# Altium schematic sheet CubSat3.SchDoc: CubSat
size A4; DrawnBy: Maymoun Jabnouni; SheetNumber: 3; SheetTotal: 3
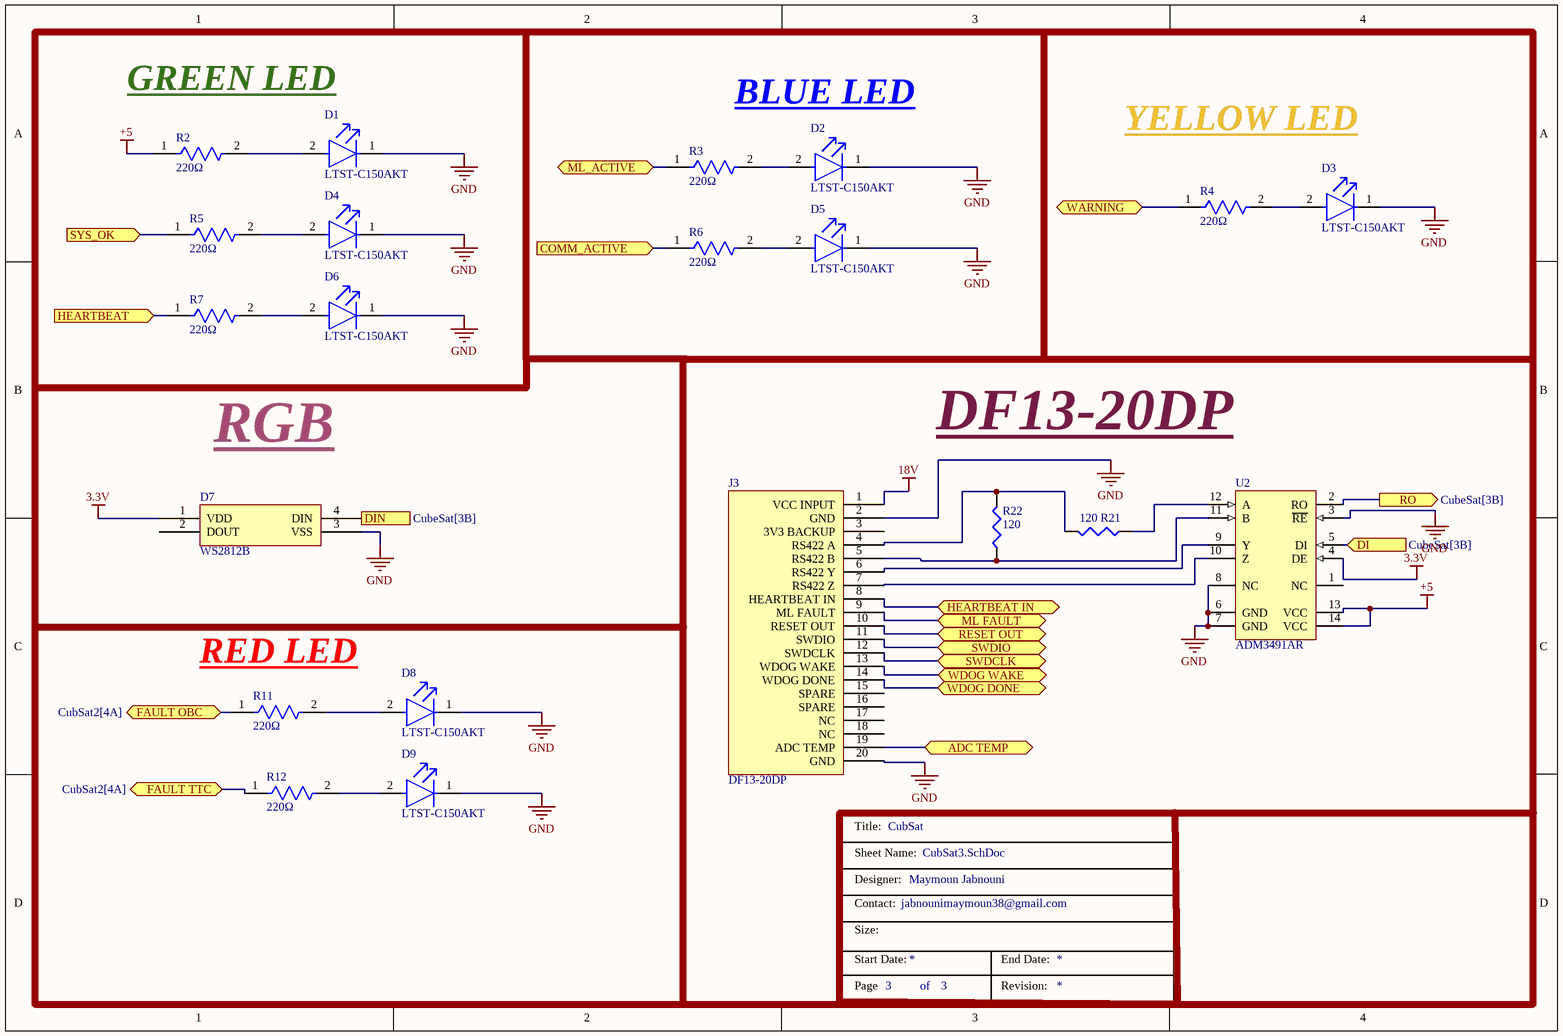
[diagram p0: CubSat3.SchDoc]

## Parts
D1  LTST-C150AKT  [FP-LTST-C150AKT-MFG]
D2  LTST-C150AKT  [FP-LTST-C150AKT-MFG]
D3  LTST-C150AKT  [FP-LTST-C150AKT-MFG]
D4  LTST-C150AKT  [FP-LTST-C150AKT-MFG]
D5  LTST-C150AKT  [FP-LTST-C150AKT-MFG]
D6  LTST-C150AKT  [FP-LTST-C150AKT-MFG]
D7  WS2812B  [WS2812B]
D8  LTST-C150AKT  [FP-LTST-C150AKT-MFG]
D9  LTST-C150AKT  [FP-LTST-C150AKT-MFG]
J3  DF13-20DP  [DF13-20DP]
R2  220Ω  [FP-RMCF0603-MFG]
R3  220Ω  [FP-RMCF0603-MFG]
R4  220Ω  [FP-RMCF0603-MFG]
R5  220Ω  [FP-RMCF0603-MFG]
R6  220Ω  [FP-RMCF0603-MFG]
R7  220Ω  [FP-RMCF0603-MFG]
R11  220Ω  [FP-RMCF0603-MFG]
R12  220Ω  [FP-RMCF0603-MFG]
R21  value 120  [J1-0603]  (hidden comment: Res3)
R22  value 120  [J1-0603]  (hidden comment: Res3)
U2  ADM3491AR  [ADI-R-14_N]

## Ports
ADC TEMP (bidir, see CubeSat[1D]), COMM_ACTIVE (in, see CubeSat[2D]), DI (in, see CubeSat[3B]), DIN (in, see CubeSat[3B]), FAULT OBC (bidir, see CubSat2[4A]), FAULT TTC (bidir, see CubSat2[4A]), HEARTBEAT (in, see CubeSat[2D]), HEARTBEAT IN (bidir, see CubeSat[1B]), ML FAULT (bidir, see CubeSat[2D]), ML_ACTIVE (bidir, see CubSat2[4A]), RESET OUT (bidir, see CubeSat[3B]), RO (out, see CubeSat[3B]), SWDCLK (bidir, see CubeSat[3A], CubSat2[3B]), SWDIO (bidir, see CubeSat[3B], CubSat2[3B]), SYS_OK (in, see CubeSat[3B]), WARNING (bidir, see CubSat2[4A]), WDOG DONE (bidir, see CubeSat[2D], CubSat2[1D]), WDOG WAKE (bidir, see CubeSat[2D], CubSat2[2D])

## Nets
3.3V: D7.1(VDD) U2.4(DE)
18V: J3.1(VCC_INPUT)
+5: R2.1 U2.13(VCC) U2.14(VCC)
GND: D1.1(C) D2.1(C) D3.1(C) D4.1(C) D5.1(C) D6.1(C) D7.3(VSS) D8.1(C) D9.1(C) J3.2(GND) J3.20(GND) U2.3(~{RE}) U2.6(GND) U2.7(GND) U2.8(NC)
ADC TEMP: J3.19(ADC_TEMP) ; port ADC TEMP
COMM_ACTIVE: R6.1 ; port COMM_ACTIVE
DI: U2.5(DI) ; port DI
DIN: D7.4(DIN) ; port DIN
FAULT OBC: R11.1 ; port FAULT OBC
FAULT TTC: R12.1 ; port FAULT TTC
HEARTBEAT: R7.1 ; port HEARTBEAT
HEARTBEAT IN: J3.8(HEARTBEAT_IN) ; port HEARTBEAT IN
ML FAULT: J3.9(ML_FAULT) ; port ML FAULT
ML_ACTIVE: R3.1 ; port ML_ACTIVE
RESET OUT: J3.10(RESET_OUT) ; port RESET OUT
RO: U2.2(RO) ; port RO
SWDCLK: J3.12(SWDCLK) ; port SWDCLK
SWDIO: J3.11(SWDIO) ; port SWDIO
SYS_OK: R5.1 ; port SYS_OK
WARNING: R4.1 ; port WARNING
WDOG DONE: J3.14(WDOG_DONE) ; port WDOG DONE
WDOG WAKE: J3.13(WDOG_WAKE) ; port WDOG WAKE
NetD1_2: D1.2(A) R2.2
NetD2_2: D2.2(A) R3.2
NetD3_2: D3.2(A) R4.2
NetD4_2: D4.2(A) R5.2
NetD5_2: D5.2(A) R6.2
NetD6_2: D6.2(A) R7.2
NetD8_2: D8.2(A) R11.2
NetD9_2: D9.2(A) R12.2
NetJ3_4: J3.4(RS422_A) R21.2 R22.2
NetJ3_5: J3.5(RS422_B) R22.1 U2.11(B)
NetJ3_6: J3.6(RS422_Y) U2.9(Y)
NetJ3_7: J3.7(RS422_Z) U2.10(Z)
NetR21_1: R21.1 U2.12(A)

Not connected (* = marked no-connect by the designer): D7 2(DOUT_); J3 3(3V3_BACKUP) 15(SPARE) 16(SPARE) 17(NC) 18(NC); U2 1(NC)

## Notes on the sheet
- GREEN LED
- BLUE LED
- YELLOW LED
- RGB
- DF13-20DP
- (near R11) RED LED
- Title:
- Sheet Name:
- Designer:
- Contact:
- jabnounimaymoun38@gmail.com
- Size:
- Start Date:
- Page
- of
- End Date:
- Revision:

## Library data of the parts
D1-D6 D8 D9 = CMP-22017-000004-1: LED AMBER CLEAR SMD; Manufacturer: Lite-On; Luminous Intensity: 6mcd; Viewing Angle: 130°; Wavelength: 602nm; Reverse Voltage: 5V; Forward Current: 30mA; Led Orientation: Top View; Power Dissipation: 100mW; Peak Emmision Wavelength: 610nm; Forward Voltage: 2.1V; ComponentLink2Description: Datasheet; Device Class L3: unset; Height: 1.2mm; RoHS: TRUE; ComponentLink2URL: https://media.digikey.com/pdf/Data%20Sheets/Lite-On%20PDFs/LTST-C150AKT.pdf; Temperature: -55°C to +85°C; Package: 0; Automotive: No; Manufacturer Part Number: LTST-C150AKT; Temperature Range Low: -55°C; Device Class L2: LEDs; Device Class L1: Optoelectronics; Octopart: https://octopart.com/ltst-c150akt-lite-on-549804; Digikey Description: LED AMBER CLEAR SMD; Colour: Amber; Category: Diode; Mouser Description: Standard LEDs - SMD Amber Clear 602nm; Lead Free: Yes; Temperature Range High: +85°C
D7 = RGB_LED: pin to pad: 1>A1 2>B1 3>B2 4>A2
R2-R7 R11 R12 = CMP-26527-002055-1: 220Ω ±5% 0.1W 0603 Thick Film Chip Resistor AEC-Q200 compliant; Resistance: 220R; Temperature Coefficient: 100ppm/°C; Min Operating Temperature: -55°C; Contact Plating: Tin; Max Operating Temperature: 155°C; Radiation Hardening: No; Tolerance: 5%; RoHS Compliant: Yes; Packaging: Tape and Reel; Mount: Surface Mount; Case/Package: 0603; Resistor Type: Thick Film
R21 R22 = Res3: Resistor; Published: 8-Jun-2000; LatestRevisionDate: 29-May-2009; LatestRevisionNote: IPC-7351 Footprint Added.; PackageReference: J1-0603; Publisher: Altium Limited; PackageDescription: Chip Resistor
U2 = CMP-0535-00054-1: 3.3 V Slew Rate Limited, Full-Duplex, RS-485/RS-422 Transceivers, 3 to 3.6 V, -40 to 85 degC, 14-Pin SOIC (R-14), Tube; Manufacturer: Analog Devices; Receiver Hysteresis: 50 mV; Duplex: Full; Guaranteed Data Rate: 10 Mbps; Number of Drivers: 1; Temperature Range: -40 to 85 degC; Packing: Tube; Mounting Technology: Surface Mount; DatasheetVersion: Rev. E; ComponentLink3URL: http://www.analog.com/media/en/package-pcb-resources/package/pkg_pdf/soic_narrow-r/r_14.pdf; PartNumber: ADM3491AR; ComponentLink3Description: Package Specification; ComponentLink1Description: Manufacturer URL; PackageVersion: 06/2006; Supply Voltage: 3 to 3.6 V; ComponentLink2URL: http://www.analog.com/static/imported-files/data_sheets/ADM3483_3485_3488_3490_3491.pdf; ComponentLink2Description: Datasheet; ComponentLink1URL: http://www.analog.com/en/index.html; PackageDescription: 14-Pin Standard Small Outline Package, Body 8.65 x 3.9 mm, Pitch 1.27 mm